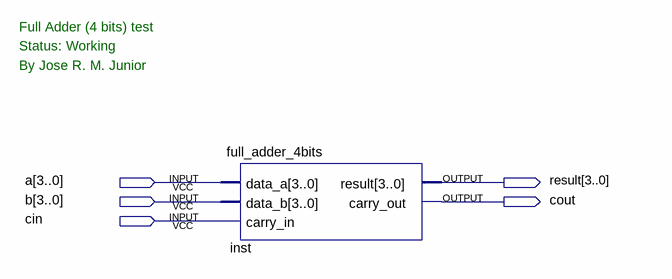
[diagram p0: schematic sheet]
// Quartus schematic full_adder_4bits_test.bdf as structural Verilog: 1 symbols, 5 pins
module full_adder_4bits_test (
  input  [3:0] a,
  input  [3:0] b,
  input  cin,
  output [3:0] result,
  output cout
);

  full_adder_4bits inst (.data_a(a), .data_b(b), .carry_in(cin), .result(result), .carry_out(cout));

  // Notes on the sheet:
  //   Full Adder (4 bits) test
  //   Status: Working
  //   By Jose R. M. Junior
endmodule
